# Altium schematic sheet Power_Board_Clone.SchDoc: MAIN POWER 5V / 3V3 / 1V8
size A4; Date: Not used; ApprovedBy: Not used; CheckedBy: Not used; Author: Not used; CompanyName: STMicroelectronics; DrawnBy: Not used; Engineer: Not used; Organization: Not used; Address1: Not used; Address2: Not used; Address3: Not used; Address4: Not used; DocumentNumber: 9; Revision: Not used; SheetNumber: 8; SheetTotal: 9; CurrentTime: Not used; CurrentDate: Not used; Time: Not used; DocumentFullPathAndName: Not used; DocumentName: Not used; ModifiedDate: Not used; ImagePath: Not used; ProjectName: Not used; Application_BuildNumber: Not used
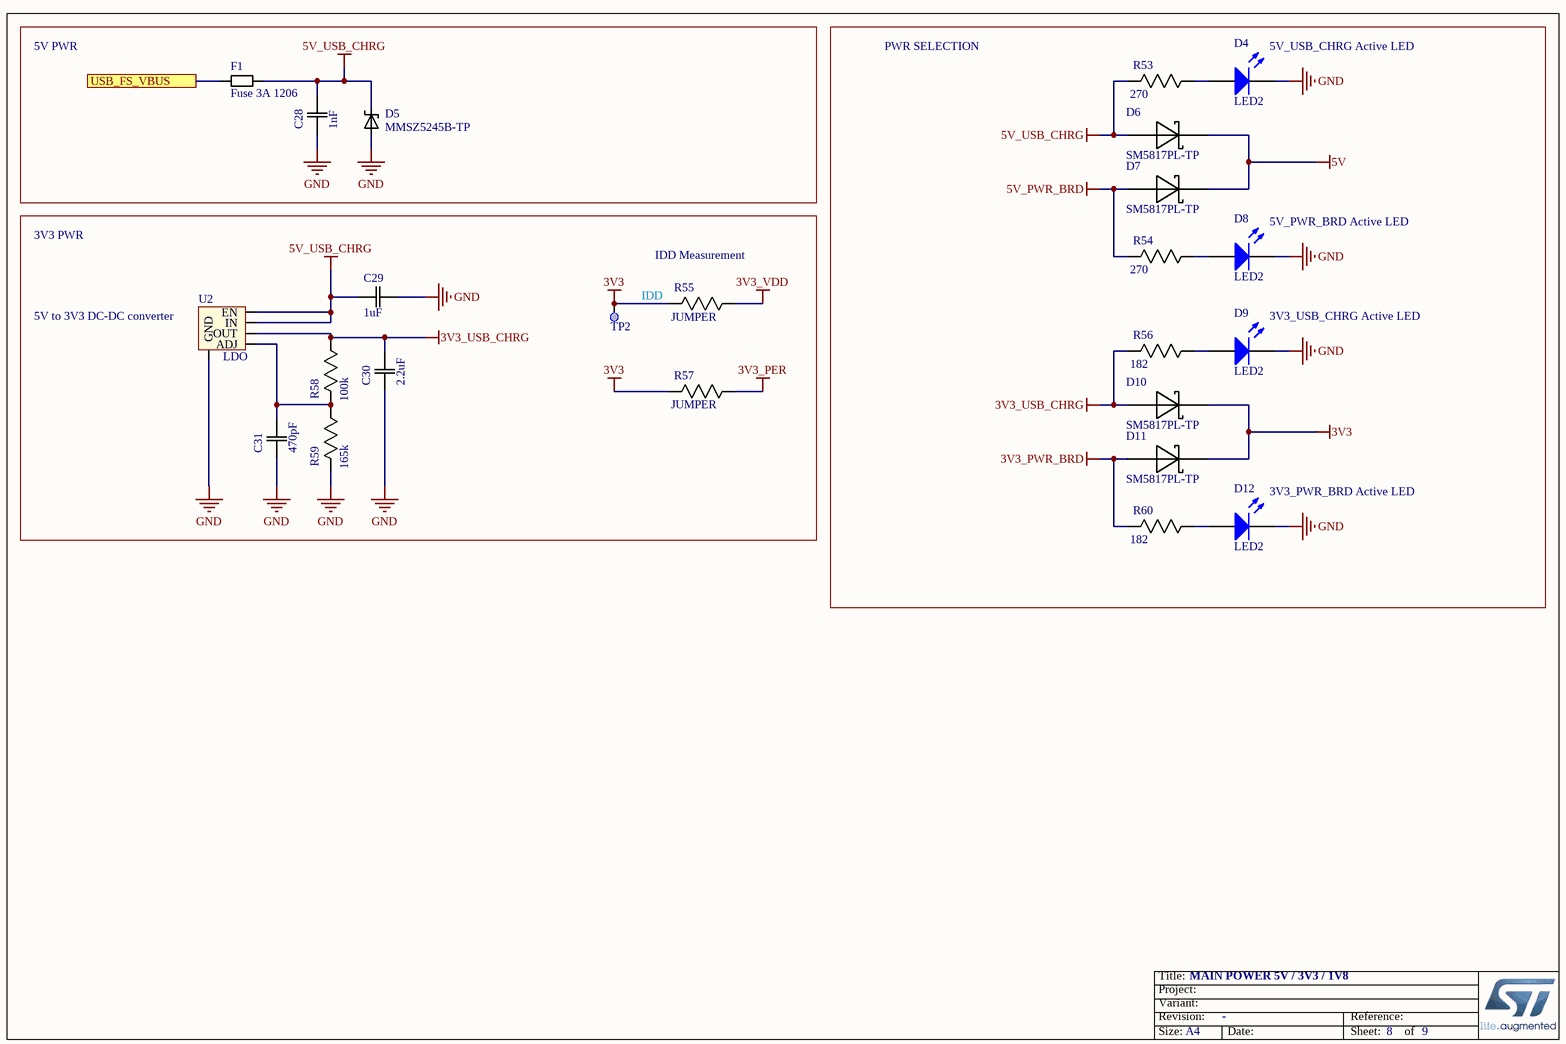
[diagram p0: Power_Board_Clone.SchDoc]

## Parts
C28  1nF  [0805]
C29  1uF  [0805]
C30  2.2uF  [0805]
C31  470pF  [0805]
D4  LED2  [3.2X1.6X1.1]
D5  MMSZ5245B-TP  [SOD-123]
D6  SM5817PL-TP  [SOD-123]
D7  SM5817PL-TP  [SOD-123]
D8  LED2  [3.2X1.6X1.1]
D9  LED2  [3.2X1.6X1.1]
D10  SM5817PL-TP  [SOD-123]
D11  SM5817PL-TP  [SOD-123]
D12  LED2  [3.2X1.6X1.1]
F1  Fuse 3A 1206  [1206]
R53  270  [0805]
R54  270  [0805]
R55  JUMPER  [0805]
R56  182  [0805]
R57  JUMPER  [0805]
R58  100k  [0805]
R59  165k  [0805]
R60  182  [0805]
TP2  Test Point  [TP_SMD_1MM]  (value not drawn)  (no BOM)
U2  LDO  [REG LIN POS ADJ 500MA 8SOIC]

## Blocks framed on the sheet
5V PWR: C28 D5 F1

## Ports
USB_FS_VBUS

## Nets
3V3: D10.C(K) D11.C(K) R55.2(R2) R57.2(R2) TP2.1
3V3_PER: R57.1(R1)
3V3_PWR_BRD: D11.A R60.2(R2)
3V3_USB_CHRG: C30.2(C2) D10.A R56.2(R2) R58.1(R1) U2.OUT
3V3_VDD: R55.1(R1)
5V: D6.C(K) D7.C(K)
5V_PWR_BRD: D7.A R54.2(R2)
5V_USB_CHRG: C28.2(C2) C29.1(C1) D5.C D6.A F1.2 R53.2(R2) U2.EN U2.IN
GND: C28.1(C1) C29.2(C2) C30.1(C1) C31.1(C1) D4.2(K) D5.A D8.2(K) D9.2(K) D12.2(K) R59.2(R2) U2.GND
USB_FS_VBUS: F1.1 ; port USB_FS_VBUS
NetC31_2: C31.2(C2) R58.2(R2) R59.1(R1) U2.ADJ
NetD4_1: D4.1(A) R53.1(R1)
NetD8_1: D8.1(A) R54.1(R1)
NetD9_1: D9.1(A) R56.1(R1)
NetD12_1: D12.1(A) R60.1(R1)

## Notes on the sheet
- PWR SELECTION
- (near D4) 5V_USB_CHRG Active LED
- 3V3 PWR
- (near R55) IDD Measurement
- (near D8) 5V_PWR_BRD Active LED
- (near U2) 5V to 3V3 DC-DC converter
- IDD
- (near D9) 3V3_USB_CHRG Active LED
- (near D12) 3V3_PWR_BRD Active LED
- Title:
- Project:
- Size:
- Revision:
- Variant:
- A4
- -
- Date:
- Reference:
- Sheet:
- of

## Library data of the parts
C28 = CAP 1nF 0805: CAP CER 1000PF 50V X7R 0805; MP: CC0805KRX7R9BB102; MF: Yageo; Tolerance: 10%; Package: 0805; Price: 0.1 CAD; Value: 1nF; Digikey: 311-1127-1-ND; Digikey Link: https://www.digikey.ca/products/en?keywords=311-1127-1-ND; Rating: 50V
C29 = CAP 1uF 0805: CAP CER 1UF 50V X7R 0805; MP: CL21B105KBFNNNE; MF: Samsung Electro-Mechanics; Tolerance: 10%; Package: 0805; Price: 0,172 CAD; Value: 1uF; Digikey: 1276-1029-1-ND; Digikey Link: https://www.digikey.ca/product-detail/en/samsung-electro-mechanics/CL21B105KBFNNNE/1276-1029-1-ND/3889115; Rating: 50V
C30 = CAP 2.2uF 0805: CAP CER 1UF 50V X7R 0805; MP: C0805C225K4RACTU; MF: KEMET; Tolerance: 10%; Rating: 16V; Package: 0805; Price: 0,461 CAD; Value: 2.2uF; Digikey: 399-3523-1-ND; Digikey Link: https://www.digikey.ca/products/en?keywords=399-3523-1-ND
C31 = CAP 470pF 0805: CAP CER 470PF 50V C0G/NPO 0805; MP: CC0805JRNPO9BN471; MF: Yageo; Tolerance: 5%; Package: 0805; Price: 0,135 CAD; Value: 470pF; Digikey: 311-1119-1-ND; Digikey Link: https://www.digikey.ca/products/en?keywords=311-1119-1-ND; Rating: 50V
D4 D8 D9 D12 = LED GREEN SMD: Typical RED, GREEN, YELLOW, AMBER GaAs LED; MF: Lite-On Inc.; MP: LTST-C191KGKT; Rating: 2V; Digikey: 160-1446-1-ND; Digikey Link: https://www.digikey.ca/products/en?keywords=160-1446-1-ND; Package: 0603
D5 = MMSZ5245B-TP: Zener Diode 15V 500mW ±5% Surface Mount SOD-123; MP: MMSZ5224BT1G; MF: ON Semiconductor; Price: None; SnapEDA_Link: https://www.snapeda.com/parts/MMSZ5224BT1G/ON%20Semiconductor/view-part/230941/?ref=snap; Package: SOD-123 ON Semiconductor; Availability: Unavailable; Value: *; ComponentLink1Description: digikey; ComponentLink1URL: https://www.digikey.ca/en/products/detail/micro-commercial-co/MMSZ5245B-TP/1793206
D6 D7 D10 D11 = SM5817PL-TP: Diode Schottky 20V 1A Surface Mount SOD-123FL; MF: Micro Commercial Co; ComponentLink1Description: digikey; ComponentLink1URL: https://www.digikey.ca/product-detail/en/on-semiconductor/MBR0540T1G/MBR0540T1GOSCT-ND/917967; Digikey: SM5817PL-TPMSCT-ND; Digikey Link: https://www.digikey.ca/product-detail/en/micro-commercial-co/SM5817PL-TP/SM5817PL-TPMSCT-ND/1793410; MP: SM5817PL-TP; Voltage Rating: 20V; Package: SOD-123; Current Rating: 1A
F1 = Fuse 3A 1206: FUSE 3.0A 63VAC/DC SLOW 1206; MF: Bel Fuse Inc.; MP: 0685T3000-01; Digikey: 507-1896-6-ND; Rating: 3A; Digikey Link: https://www.digikey.ca/product-detail/en/bel-fuse-inc/0685T3000-01/507-1896-6-ND/4968212
R53 R54 = RES 270 0805: RES SMD 270 OHM 5% 1/8W 0805; MP: RC0805JR-07270RL; MF: Yageo; Rating: 0.125W; Digikey: 311-270ARCT-ND; Price: 0.054 CAD; Package: 0805; Value: 270; Digikey Link: https://www.digikey.ca/product-detail/en/yageo/RC0805JR-07270RL/311-270ARCT-ND/731238
R55 R57 = RES 0 0805: RES SMD 0 OHM JUMPER 1/8W 0805; MP: RC0805JR-070RL; MF: Yageo; Value: 0; Rating: 0.125W; Digikey: 311-0.0ARCT-ND; Price: 0.058 CAD; Package: 0805; Digikey Link: https://www.digikey.ca/products/en?keywords=311-0.0ARCT-ND
R56 R60 = RES 182 0805: RES SMD 182 OHM 1% 1/8W 0805; MP: ERJ-6ENF1820V; MF: Panasonic Electronic Components; Rating: 0.125W; Digikey: P182CCT-ND; Price: 0.15 CAD; Package: 0805; Value: 182; Digikey Link: https://www.digikey.ca/product-detail/en/panasonic-electronic-components/ERJ-6ENF1820V/P182CCT-ND/118743; Tolerance: 1%
R58 = RES 100k 0805: RES SMD 100K OHM 1% 1/8W 0805; MP: RC0805FR-07100KL; MF: Yageo; Rating: 0.125W; Digikey: 311-100KCRCT-ND; Price: 0.058 CAD; Package: 0805; Value: 100k; Digikey Link: https://www.digikey.ca/products/en?keywords=311-100KCRCT-ND; Tolerance: 1%
R59 = RES 165k 0805: 165 kOhms ±1% 0.25W, 1/4W Chip Resistor 0805 (2012 Metric) Automotive AEC-Q200, Moisture Resistant Thick Film; MP: RK73H2ATTD1653F; MF: KOA Speer Electronics, Inc.; Digikey: 2019-RK73H2ATTD1653FCT-ND; Price: 0.15 CAD; Package: 0805; Value: 165k; Rating: 0.25W; Digikey Link: https://www.digikey.ca/product-detail/en/koa-speer-electronics-inc/RK73H2ATTD1653F/2019-RK73H2ATTD1653FCT-ND/10235747
TP2 = MCD-00074: Test Point 1mm; Part_Type: Mechanical; Internal_Part_Number: MCD-00074; Provided_By: n/a; Status: Released; ComponentLink1Description: Datasheet; ComponentLink1URL: http://na; Manufacturer: n/a; Manufacturer_Part_Number: n/a; ECCN_US: n/a; ECCN_EU: n/a
U2 = REG LIN POS ADJ: Linear Voltage Regulator IC  1 Output  500mA 8-SOIC; MF: Texas Instruments; MP: TL5209DR; Digikey: 296-21569-1-ND; Digikey Link: https://www.digikey.ca/product-detail/en/texas-instruments/TL5209DR/296-21569-1-ND/1427137; Price: 1.548 CAD; Rating: 500mA; Package: 8 SOIC